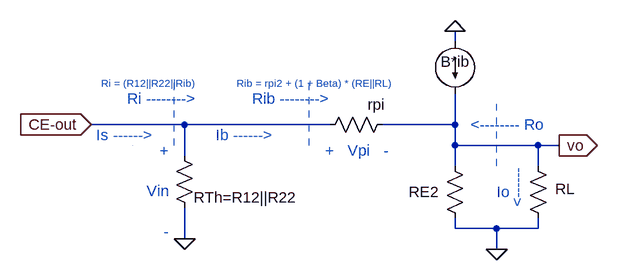
[diagram p0: schematic casc_cc__small-signal.asc]
casc_cc__small-signal.asc, the LTspice schematic file:
Version 4
SHEET 1 996 680
WIRE 640 -32 640 -48
WIRE 224 96 80 96
WIRE 448 96 224 96
WIRE 640 96 640 48
WIRE 640 96 528 96
WIRE 640 128 640 96
WIRE 768 128 640 128
WIRE 800 128 768 128
WIRE 224 144 224 96
WIRE 640 160 640 128
WIRE 768 160 768 128
WIRE 640 256 640 240
WIRE 704 256 640 256
WIRE 768 256 768 240
WIRE 768 256 704 256
WIRE 224 272 224 224
WIRE 704 288 704 256
FLAG 704 288 0
FLAG 640 -48 0
FLAG 224 272 0
FLAG 800 128 vo
IOPIN 800 128 Out
FLAG 80 96 CE-out
IOPIN 80 96 In
SYMBOL res 208 128 R0
WINDOW 0 30 80 Left 2
SYMATTR InstName RTh=R12||R22
SYMATTR Value ""
SYMBOL res 544 80 R90
WINDOW 0 1 25 VBottom 2
WINDOW 3 32 56 VTop 2
SYMATTR InstName rpi
SYMATTR Value ""
SYMBOL res 656 256 R180
WINDOW 0 41 56 Left 2
WINDOW 3 36 40 Left 2
SYMATTR InstName RE2
SYMATTR Value ""
SYMBOL current 640 -32 R0
WINDOW 0 -22 31 Left 2
SYMATTR InstName B*ib
SYMATTR Value ""
SYMBOL res 784 256 R180
WINDOW 0 -41 61 Left 2
WINDOW 3 36 40 Left 2
SYMATTR InstName RL
SYMATTR Value ""
TEXT 328 56 Left 2 ;Rib -------->
TEXT 136 56 Left 2 ;Ri -------->
TEXT 664 96 Left 2 ;<-------- Ro
TEXT 440 136 Left 2 ;+   Vpi   -
TEXT 736 160 VRight 2 ;<------
TEXT 704 200 Left 2 ;Io
TEXT 272 112 Left 2 ;Ib ------>
TEXT 88 112 Left 2 ;Is ------>
TEXT 200 136 Right 2 ;+\n \nVin\n \n-
TEXT 304 32 Left 1 ;Rib = rpi2 + (1 + Beta) * (RE||RL)
TEXT 96 32 Left 1 ;Ri = (R12||R22||Rib)
LINE Normal 144 32 144 32 2
LINE Normal 208 128 208 32 2
LINE Normal 144 128 144 128 2
LINE Normal 416 128 416 32 2
LINE Normal 704 160 704 64 2

The netlist it stands for:
* casc_cc__small-signal.asc
RTh=R12||R22 CE-out 0
rpi vo CE-out
RE2 0 vo
I§B*ib 0 vo
RL 0 vo
* Rib -------->
* Ri -------->
* <-------- Ro
* +   Vpi   -
* <------
* Io
* Ib ------>
* Is ------>
* +
* Vin
* -
* Rib = rpi2 + (1 + Beta) * (RE||RL)
* Ri = (R12||R22||Rib)
.backanno
.end